# Altium schematic sheet power.SCHDOC
size B
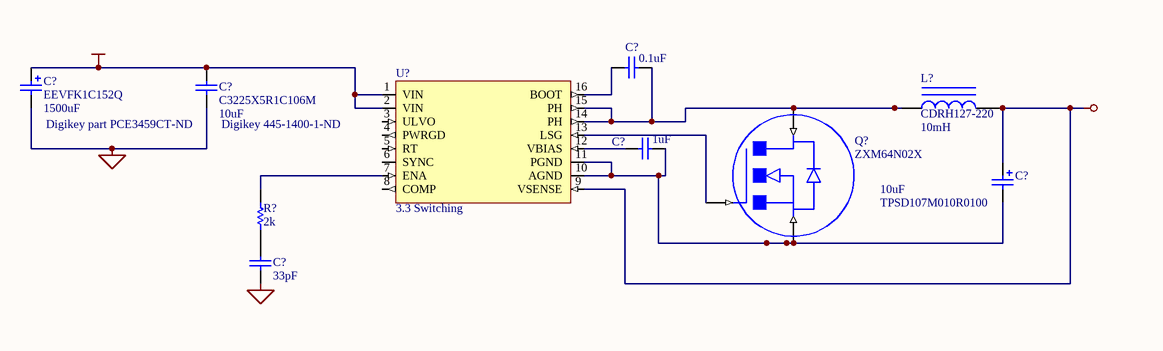
[diagram p0: power.SCHDOC]

## Parts
(Parts that share a designator on the sheet are numbered #1, #2 ... from top to bottom, then left to right.)
C?#1  value 0.1uF  [CC1608-0603]  (hidden comment: Cap)
C?#2  EEVFK1C152Q  value 1500uF  Manufacturer: Digikey part PCE3459CT-ND  [PanasonicE]
C?#3  C3225X5R1C106M  value 10uF  Manufacturer: Digikey 445-1400-1-ND  [CC3225-1210]
C?#4  value 1uF  [CC1608-0603]  (hidden comment: Cap)
C?#5  TPSD107M010R0100  value 10uF  [TC7360-2924]
C?#6  value 33pF  [CC1608-0603]  (hidden comment: Cap)
L?  CDRH127-220  value 10mH  [SUMIDA Inductor]
Q?  ZXM64N02X  [MSOP8]
R?  value 2k  [CC1608-0603]  (hidden comment: Res1)
U?  3.3 Switching

## Nets
+12VCC: C?#2.1 C?#3.1 U?.1(VIN) U?.2(VIN)
GND: C?#2.2 C?#3.2 C?#6.2
VCC2: C?#5.1 L?.2 U?.9(VSENSE)
NetC?#1_1: C?#1.1 U?.16(BOOT)
NetC?#1_2: C?#1.2 L?.1 Q?.5(D) U?.14(PH) U?.15(PH)
NetC?#4_1: C?#4.1 U?.12(VBIAS)
NetC?#4_2: C?#4.2 C?#5.2 Q?.1(S) U?.10(AGND) U?.11(PGND)
NetC?#6_1: C?#6.1 R?.1
NetQ?_4: Q?.4(G) U?.13(LSG)
NetR?_2: R?.2 U?.7(ENA)

Not connected (* = marked no-connect by the designer): Q? 2(S) 3(S) 6(D) 7(D) 8(D); U? 3(ULVO) 4(PWRGD) 5(RT) 6(SYNC) 8(COMP)

## Library data of the parts
C?#1 C?#4 C?#6 = Cap: Capacitor; Manufacturer: Generic Components; Class I: Passive; Published: 8-Jun-2000; Revision: July-2002: Re-released for DXP Platform.; Publisher: Altium Limited; Class II: Capacitor
C?#2 = Cap Pol1: Input Bulk Cap; Class I: Passive; Class II: Capacitor; Published: 8-Jun-2000; Revision: July-2002: Re-released for DXP Platform.; Publisher: Altium Limited
C?#3 = Cap: Input Bypass Cap; Class I: Passive; Class II: Capacitor; Published: 8-Jun-2000; Revision: July-2002: Re-released for DXP Platform.; Publisher: Altium Limited
C?#5 = Cap Pol1: Polarized Capacitor (Radial); Manufacturer: Generic Components; Class I: Passive; Published: 8-Jun-2000; Revision: July-2002: Re-released for DXP Platform.; Publisher: Altium Limited; Class II: Capacitor
L? = Inductor Iron: Magnetic-Core Inductor; Manufacturer: Generic Components; Class I: Passive; Published: 24-Mar-1999; Revision: July-2002: Re-released for DXP Platform.; Publisher: Altium Limited; Class II: Inductor
Q? = N-CHAN ENH MOSFET
R? = Res1: Resistor; Manufacturer: Generic Components; Class I: Passive; Published: 8-Jun-2000; Revision: July-2002: Re-released for DXP Platform.; Publisher: Altium Limited; Class II: Resistor
U? = TPS54356: TI 3A 3.3V out switching Regulator